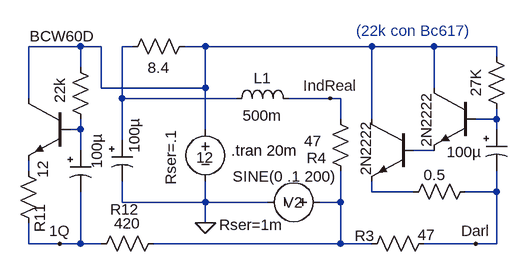
[diagram p0: schematic Gyr.asc]
Gyr.asc, the LTspice schematic file:
Version 4
SHEET 1 880 680
WIRE -1072 336 -1072 256
WIRE -1072 448 -1072 432
WIRE -1072 560 -1072 528
WIRE -1024 560 -1072 560
WIRE -992 256 -1072 256
WIRE -992 288 -992 256
WIRE -992 384 -1008 384
WIRE -992 384 -992 368
WIRE -992 416 -992 384
WIRE -992 560 -1024 560
WIRE -992 560 -992 480
WIRE -960 256 -992 256
WIRE -960 320 -960 256
WIRE -960 560 -992 560
WIRE -928 336 -928 256
WIRE -928 400 -928 336
WIRE -928 496 -928 464
WIRE -912 256 -928 256
WIRE -800 256 -832 256
WIRE -800 320 -960 320
WIRE -800 320 -800 256
WIRE -800 384 -800 320
WIRE -800 496 -928 496
WIRE -800 496 -800 464
WIRE -800 528 -800 496
WIRE -752 336 -928 336
WIRE -704 496 -800 496
WIRE -608 336 -672 336
WIRE -592 336 -608 336
WIRE -592 368 -592 336
WIRE -592 496 -624 496
WIRE -592 496 -592 448
WIRE -592 560 -880 560
WIRE -592 560 -592 496
WIRE -544 256 -800 256
WIRE -544 368 -544 256
WIRE -544 480 -544 464
WIRE -544 560 -592 560
WIRE -480 480 -544 480
WIRE -448 256 -544 256
WIRE -448 320 -448 256
WIRE -448 416 -480 416
WIRE -384 560 -464 560
WIRE -352 256 -448 256
WIRE -352 272 -352 256
WIRE -352 368 -384 368
WIRE -352 368 -352 352
WIRE -352 384 -352 368
WIRE -352 480 -400 480
WIRE -352 480 -352 448
WIRE -352 560 -384 560
WIRE -352 560 -352 480
FLAG -800 528 0
FLAG -608 336 IndReal
FLAG -1024 560 1Q
FLAG -384 560 Darl
SYMBOL res -336 368 R180
WINDOW 0 0 56 Invisible 0
WINDOW 3 32 56 VTop 0
SYMATTR InstName R1
SYMATTR Value 27K
SYMATTR SpiceLine tol=1 pwr=0.1
SYMBOL res -384 464 R90
WINDOW 0 36 40 Invisible 0
WINDOW 3 -10 46 VRight 0
SYMATTR InstName R2
SYMATTR Value 0.5
SYMATTR SpiceLine tol=1 pwr=0.1
SYMBOL polcap -368 384 R0
WINDOW 3 -61 35 Left 0
WINDOW 0 24 8 Invisible 0
SYMATTR Value 100µ
SYMATTR InstName C1
SYMATTR Description Capacitor
SYMATTR Type cap
SYMATTR SpiceLine V=6.3 Irms=285m Rser=0.3 MTBF=2000 Lser=0 mfg="Nichicon" pn="UPL0J221MPH" type="Al electrolytic" ppPkg=1
SYMBOL npn3 -384 320 M0
WINDOW 0 56 32 Invisible 0
WINDOW 3 76 91 VLeft 0
SYMATTR InstName Q1
SYMATTR Value 2N2222
SYMBOL voltage -800 368 R0
WINDOW 39 -53 16 VRight 0
WINDOW 0 24 16 Invisible 0
WINDOW 3 -14 59 Left 0
SYMATTR SpiceLine Rser=.1
SYMATTR InstName V1
SYMATTR Value 12
SYMBOL res -448 544 R90
WINDOW 0 -12 107 VTop 0
WINDOW 3 -13 12 VTop 0
SYMATTR InstName R3
SYMATTR Value 47
SYMATTR SpiceLine tol=1 pwr=0.1
SYMBOL voltage -608 496 R90
WINDOW 0 -15 57 VTop 0
WINDOW 3 -55 70 VTop 0
WINDOW 39 19 121 VTop 0
SYMATTR InstName V2
SYMATTR Value SINE(0 .1 200)
SYMATTR SpiceLine Rser=1m
SYMBOL npn3 -480 368 M0
WINDOW 0 56 32 Invisible 0
WINDOW 3 73 87 VLeft 0
SYMATTR InstName Q2
SYMATTR Value 2N2222
SYMBOL ind -768 352 R270
WINDOW 0 32 56 VTop 0
WINDOW 3 5 56 VBottom 0
SYMATTR InstName L1
SYMATTR Value 500m
SYMATTR SpiceLine Ipk=1.5 Rser=1.3 Rpar=45000 Cpar=220f
SYMBOL res -608 352 R0
WINDOW 0 -36 76 Left 0
WINDOW 3 -40 50 Left 0
SYMATTR InstName R4
SYMATTR Value 47
SYMATTR SpiceLine tol=1 pwr=0.1
SYMBOL res -816 240 R90
WINDOW 0 36 40 Invisible 0
WINDOW 3 49 39 VRight 0
SYMATTR InstName R9
SYMATTR Value 8.4
SYMATTR SpiceLine tol=1 pwr=0.1
SYMBOL polcap -944 400 R0
WINDOW 3 35 -34 VRight 0
WINDOW 0 24 8 Invisible 0
SYMATTR Value 100µ
SYMATTR InstName C3
SYMATTR Description Capacitor
SYMATTR Type cap
SYMATTR SpiceLine V=10 Irms=110m Rser=1.8 MTBF=1000 Lser=0 mfg="Nichicon" pn="UPR1A101MAH" type="Al electrolytic" ppPkg=1
SYMBOL npn3 -1008 336 M0
WINDOW 0 56 32 Invisible 0
WINDOW 3 62 -96 Right 0
SYMATTR InstName Q5
SYMATTR Value BCW60D
SYMBOL res -976 384 R180
WINDOW 0 36 40 Invisible 0
WINDOW 3 48 40 VRight 0
SYMATTR InstName R10
SYMATTR Value 22k
SYMATTR SpiceLine tol=1 pwr=0.1
SYMBOL polcap -1008 416 R0
WINDOW 0 24 8 Invisible 0
WINDOW 3 41 -26 VRight 0
SYMATTR InstName C4
SYMATTR Value 100µ
SYMATTR Description Capacitor
SYMATTR Type cap
SYMATTR SpiceLine V=6.3 Irms=285m Rser=0.3 MTBF=2000 Lser=0 ppPkg=1
SYMBOL res -1088 432 R0
WINDOW 0 33 67 VRight 0
WINDOW 3 38 0 VRight 0
SYMATTR InstName R11
SYMATTR Value 12
SYMATTR SpiceLine tol=1 pwr=0.1
SYMBOL res -976 576 R270
WINDOW 0 53 52 VTop 0
WINDOW 3 32 56 VTop 0
SYMATTR InstName R12
SYMATTR Value 420
SYMATTR SpiceLine tol=1 pwr=0.1
TEXT -760 416 Left 0 !.tran 20m
TEXT -568 232 Left 0 ;(22k con Bc617)

The netlist it stands for:
* Gyr.asc
R1 N008 N001 27K tol=1 pwr=0.1
R2 Darl N006 0.5 tol=1 pwr=0.1
C1 N008 Darl 100µ V=6.3 Irms=285m Rser=0.3 MTBF=2000 Lser=0 mfg="Nichicon" pn="UPL0J221MPH" type="Al electrolytic" ppPkg=1
Q1 N001 N008 N007 0 2N2222
V1 N001 0 12 Rser=.1
R3 Darl N005 47 tol=1 pwr=0.1
V2 N005 0 SINE(0 .1 200) Rser=1m
Q2 N001 N007 N006 0 2N2222
L1 N004 IndReal 500m Ipk=1.5 Rser=1.3 Rpar=45000 Cpar=220f
R4 IndReal N005 47 tol=1 pwr=0.1
R9 N001 N004 8.4 tol=1 pwr=0.1
C3 N004 0 100µ V=10 Irms=110m Rser=1.8 MTBF=1000 Lser=0 mfg="Nichicon" pn="UPR1A101MAH" type="Al electrolytic" ppPkg=1
Q5 N001 N003 N002 0 BCW60D
R10 N003 N001 22k tol=1 pwr=0.1
C4 N003 1Q 100µ V=6.3 Irms=285m Rser=0.3 MTBF=2000 Lser=0 ppPkg=1
R11 N002 1Q 12 tol=1 pwr=0.1
R12 1Q N005 420 tol=1 pwr=0.1
.model NPN NPN
.model PNP PNP
.lib standard.bjt
.tran 20m
* (22k con Bc617)
.backanno
.end